# Altium schematic sheet SAMD_Arduino_1.SchDoc: SAMD Arduino
size A4; DrawnBy: Aakash Kumar; Organization: University of Colorado; Address1: Boulder; Address2: CO; DocumentNumber: 1; SheetNumber: 1; SheetTotal: 1
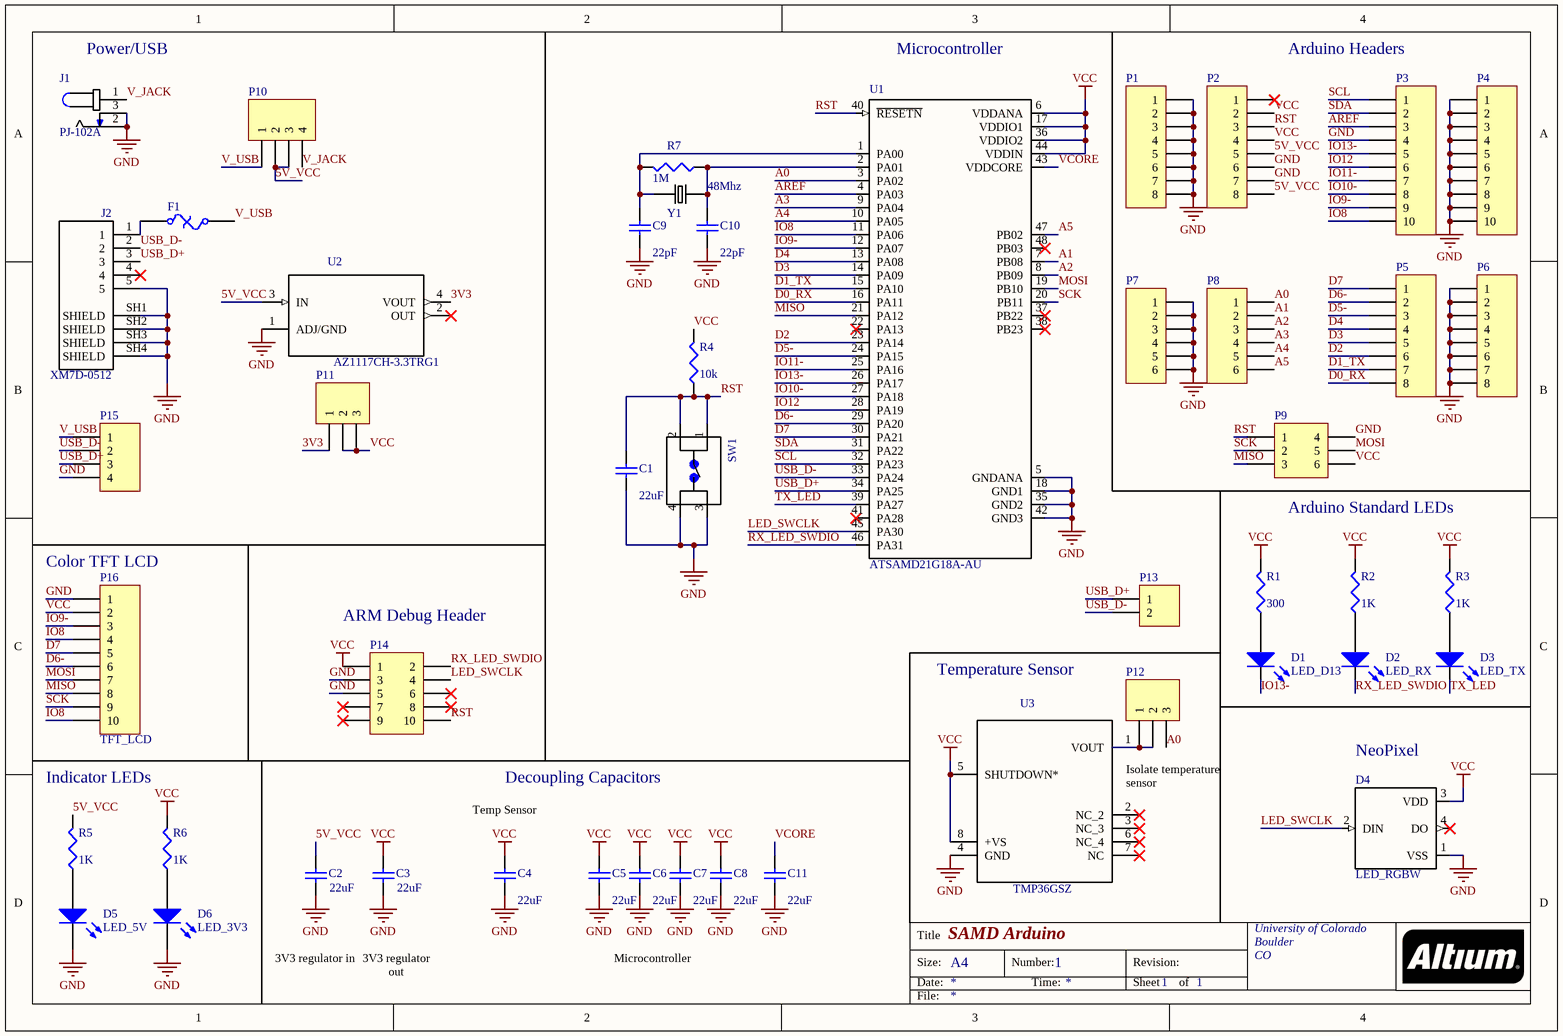
[diagram p0: SAMD_Arduino_1.SchDoc]

## Parts
C1  value 22uF  [C1206]  (hidden comment: Cap Semi)
C2  value 22uF  [C1206]  (hidden comment: Cap Semi)
C3  value 22uF  [C1206]  (hidden comment: Cap Semi)
C4  value 22uF  [C1206]  (hidden comment: Cap Semi)
C5  value 22uF  [C1206]  (hidden comment: Cap Semi)
C6  value 22uF  [C1206]  (hidden comment: Cap Semi)
C7  value 22uF  [C1206]  (hidden comment: Cap Semi)
C8  value 22uF  [C1206]  (hidden comment: Cap Semi)
C9  value 22pF  [C1206]  (hidden comment: Cap Semi)
C10  value 22pF  [C1206]  (hidden comment: Cap Semi)
C11  value 22uF  [C1206]  (hidden comment: Cap Semi)
D1  LED_D13  [3.2X1.6X1.1]
D2  LED_RX  [3.2X1.6X1.1]
D3  LED_TX  [3.2X1.6X1.1]
D4  LED_RGBW  [*LED_IN-PI554FCH]
D5  LED_5V  [3.2X1.6X1.1]
D6  LED_3V3  [3.2X1.6X1.1]
F1  Fuse Thermal  [1812]  (value not drawn)
J1  PJ-102A  [*CUI_PJ-102A]
J2  XM7D-0512  [*OMRON_XM7D-0512_XM7D-0512(Primary)]
P1  GND  [HDR1X8]  (value not drawn)
P2  P4  [HDR1X8]  (value not drawn)
P3  P1  [HDR1X10]  (value not drawn)
P4  GND  [HDR1X10]  (value not drawn)
P5  P2  [HDR1X8]  (value not drawn)
P6  GND  [HDR1X8]  (value not drawn)
P7  GND  [HDR1X6]  (value not drawn)
P8  P3  [HDR1X6]  (value not drawn)
P9  Header 3X2A  [HDR2X3_CEN]  (value not drawn)
P10  Header 4  [HDR1X4]  (value not drawn)
P11  3.3 NC  [HDR1X3]  (value not drawn)
P12  NC A0  [HDR1X3]  (value not drawn)
P13  Header 2  [HDR1X2]  (value not drawn)
P14  Header 5X2  [HDR2X5]  (value not drawn)
P15  Header 4  [HDR1X4]  (value not drawn)
P16  TFT_LCD  [HDR1X10]
R1  value 300  [C1206]  (hidden comment: Res3)
R2  value 1K  [C1206]  (hidden comment: Res3)
R3  value 1K  [C1206]  (hidden comment: Res3)
R4  value 10k  [C1206]  (hidden comment: Res3)
R5  value 1K  [C1206]  (hidden comment: Res3)
R6  value 1K  [C1206]  (hidden comment: Res3)
R7  value 1M  [C1206]  (hidden comment: Res3)
SW1  RESET  [*TE_FSM4JSMA]  (value not drawn)
U1  ATSAMD21G18A-AU  [*QFP50P900X900X120-48N]
U2  AZ1117CH-3.3TRG1  [*SOT230P696X180-4N]
U3  TMP36GSZ  [*SOIC127P600X175-8N]
Y1  value 48Mhz  [*XTAL_ECS-35-17-5PX-TR]  (hidden comment: ECS-35-17-5PX-TR)

## Nets
GND: C1.1 C2.1 C3.1 C4.1 C5.1 C6.1 C7.1 C8.1 C9.1 C10.1 C11.1 D4.1(VSS) D5.2(K) D6.2(K) J1.2 J1.3 J2.5 J2.SH1(SHIELD) J2.SH2(SHIELD) J2.SH3(SHIELD) J2.SH4(SHIELD) P1.1 P1.2 P1.3 P1.4 P1.5 P1.6 P1.7 P1.8 P2.6 P2.7 P3.4 P4.1 P4.2 P4.3 P4.4 P4.5 P4.6 P4.7 P4.8 P4.9 P4.10 P6.1 P6.2 P6.3 P6.4 P6.5 P6.6 P6.7 P6.8 P7.1 P7.2 P7.3 P7.4 P7.5 P7.6 P9.4 P14.3 P14.5 P15.4 P16.1 SW1.3 SW1.4 U1.5(GNDANA) U1.18(GND1) U1.35(GND2) U1.42(GND3) U2.1(ADJ/GND) U3.4(GND)
VCC: C3.2 C4.2 C5.2 C6.2 C7.2 C8.2 D4.3(VDD) P2.2 P2.4 P9.6 P11.2 P11.3 P14.1 P16.2 R1.2 R2.2 R3.2 R4.2 R6.2 U1.6(VDDANA) U1.17(VDDIO1) U1.36(VDDIO2) U1.44(VDDIN) U3.5(SHUTDOWN*) U3.8(+VS)
3V3: P11.1 U2.4(VOUT)
5V_VCC: C2.2 P2.5 P2.8 P10.2 P10.3 R5.2 U2.3(IN)
A0: P8.1 P12.3 U1.3(PA02)
A1: P8.2 U1.7(PB08)
A2: P8.3 U1.8(PB09)
A3: P8.4 U1.9(PA04)
A4: P8.5 U1.10(PA05)
A5: P8.6 U1.47(PB02)
AREF: P3.3 U1.4(PA03)
D0_RX: P5.8 U1.16(PA11)
D1_TX: P5.7 U1.15(PA10)
D2: P5.6 U1.23(PA14)
D3: P5.5 U1.14(PA09)
D4: P5.4 U1.13(PA08)
D5-: P5.3 U1.24(PA15)
D6-: P5.2 P16.6 U1.29(PA20)
D7: P5.1 P16.5 U1.30(PA21)
IO8: P3.10 P16.4 P16.10 U1.11(PA06)
IO9-: P3.9 P16.3 U1.12(PA07)
IO10-: P3.8 U1.27(PA18)
IO11-: P3.7 U1.25(PA16)
IO12: P3.6 U1.28(PA19)
IO13-: D1.2(K) P3.5 U1.26(PA17)
LED_SWCLK: D4.2(DIN) P14.4 U1.45(PA30)
MISO: P9.3 P16.8 U1.21(PA12)
MOSI: P9.5 P16.7 U1.19(PB10)
RST: C1.2 P2.3 P9.1 P14.10 R4.1 SW1.1 SW1.2 U1.40(~{RESETN})
RX_LED_SWDIO: D2.2(K) P14.2 U1.46(PA31)
SCK: P9.2 P16.9 U1.20(PB11)
SCL: P3.1 U1.32(PA23)
SDA: P3.2 U1.31(PA22)
TX_LED: D3.2(K) U1.39(PA27)
USB_D+: J2.3 P13.1 P15.3 U1.34(PA25)
USB_D-: J2.2 P13.2 P15.2 U1.33(PA24)
V_JACK: J1.1 P10.4
V_USB: F1.2 P10.1 P15.1
VCORE: C11.2 U1.43(VDDCORE)
NetC9_2: C9.2 R7.2 U1.1(PA00) Y1.1
NetC10_2: C10.2 R7.1 U1.2(PA01) Y1.2
NetD1_1: D1.1(A) R1.1
NetD2_1: D2.1(A) R2.1
NetD3_1: D3.1(A) R3.1
NetD5_1: D5.1(A) R5.1
NetD6_1: D6.1(A) R6.1
NetF1_1: F1.1 J2.1
NetP12_1: P12.1 P12.2 U3.1(VOUT)

Not connected (* = marked no-connect by the designer): D4 4(DO)*; J2 4*; P2 1*; P14 6* 7* 8* 9*; U1 22(PA13)* 37(PB22)* 38(PB23)* 41(PA28)* 48(PB03)*; U2 2(OUT)*; U3 2(NC_2)* 3(NC_3)* 6(NC_4)* 7(NC)*

## Notes on the sheet
- (near J1) Power/USB
- Microcontroller
- Arduino Headers
- Arduino Standard LEDs
- (near P16) Color TFT LCD
- (near P14) ARM Debug Header
- Temperature Sensor
- Indicator LEDs
- Decoupling Capacitors
- (near U3) Isolate temperature sensor
- (near D4) NeoPixel
- Temp Sensor
- 3V3 regulator in
- 3V3 regulator out
- Title
- Size:
- Date:
- A4
- Number:
- Time:
- Revision:
- Sheet
- of
- File:

## Library data of the parts
C1-C11 = Cap Semi: Capacitor (Semiconductor SIM Model); Published: 8-Jun-2000; LatestRevisionDate: 29-May-2009; LatestRevisionNote: IPC-7351 Footprint Added.; PackageReference: C1206; Publisher: Altium Limited; PackageDescription: Chip Capacitor
  C2-C8 C11: DigiKeyPartNo: 1276-3300-1-ND
  C9 C10: DigiKeyPartNo: 732-7867-1-ND
D1-D3 D5 D6 = LED2: Typical RED, GREEN, YELLOW, AMBER GaAs LED; Published: 8-Jun-2000; LatestRevisionDate: 17-Jul-2002; LatestRevisionNote: Re-released for DXP Platform.; PackageVersion: Feb-2002; PackageReference: 3.2X1.6X1.1; Publisher: Altium Limited; PackageDescription: SM LED; 2 Flat Leads
D4 = IN-PI554FCH: 5050RGB with integrated IC built in 4 PIN Â•Viewing angle: 120 degrees; MF: Inolux; Availability: Unavailable; Price: None; MP: IN-PI554FCH; Package: SMD-4 Innolux; SnapEDA_Link: https://www.snapeda.com/parts/IN-PI554FCH/Inolux/view-part/?ref=snap; Value: *; DigiKeyPartNo: 1830-1209-1-ND
F1 = Fuse Thermal: Thermal Fuse; ManufacturerPartNo: MF-MSMF050-2; Published: 24-Mar-1999; LatestRevisionDate: 17-Jul-2002; LatestRevisionNote: Re-released for DXP Platform.; PackageReference: 1812; Publisher: Altium Limited; PackageDescription: Thru-Hole; 2 Leads; DigiKeyPartNo: MF-MSMF050-2CT-ND
J1 = PJ-102A: 2.0 mm Center Pin, 2.5 A, Right Angle, Through Hole, Tapered Pins, Dc Power Jack Connector; MF: CUI Inc.; Price: None; CUI_purchase_URL: https://www.cui.com/product/interconnect/dc-power-connectors/jacks/2.0-mm-center-pin/pj-102a?utm_source=snapeda.com&utm_medium=referral&utm_campaign=snapedaBOM; Package: None; SnapEDA_Link: https://www.snapeda.com/parts/PJ-102A/CUI%20Inc./view-part/?ref=snap; Availability: Unavailable; MP: PJ-102A; Value: *
J2 = XM7D-0512: Conn Mini USB Type B SKT 5 POS 0.8mm Solder RA Thru-Hole 5 Terminal 1 Port; MF: Omron Electronics; Availability: Unavailable; MP: XM7D-0512; SnapEDA_Link: https://www.snapeda.com/parts/XM7D-0512/Omron%20Electronics%20Inc-EMC%20Div/view-part/?ref=snap; Price: None; Package: None; Value: *; ComponentLink1URL: https://www.digikey.com/product-detail/en/omron-electronics-inc-emc-div/XM7D-0512/OR1205-ND/4695531
P1 P2 P5 P6 = Header 8: Header, 8-Pin; LatestRevisionDate: 17-Jul-2002; LatestRevisionNote: Re-released for DXP Platform.; Publisher: Altium Limited
P3 P4 P16 = Header 10: Header, 10-Pin; LatestRevisionDate: 17-Jul-2002; LatestRevisionNote: Re-released for DXP Platform.; Publisher: Altium Limited
  P16: DigiKeyPartNo: 1212-1179-ND
P7 P8 = Header 6: Header, 6-Pin; LatestRevisionDate: 17-Jul-2002; LatestRevisionNote: Re-released for DXP Platform.; Publisher: Altium Limited
P9 = Header 3X2A: Header, 3-Pin, Dual row; LatestRevisionDate: 17-Jul-2002; LatestRevisionNote: Re-released for DXP Platform.; Publisher: Altium Limited
P10 P15 = Header 4: Header, 4-Pin; LatestRevisionDate: 17-Jul-2002; LatestRevisionNote: Re-released for DXP Platform.; Publisher: Altium Limited
P11 P12 = Header 3: Header, 3-Pin; LatestRevisionDate: 17-Jul-2002; LatestRevisionNote: Re-released for DXP Platform.; Publisher: Altium Limited
P13 = Header 2: Header, 2-Pin; LatestRevisionDate: 17-Jul-2002; LatestRevisionNote: Re-released for DXP Platform.; Publisher: Altium Limited
P14 = Header 5X2: Header, 5-Pin, Dual row; LatestRevisionDate: 17-Jul-2002; LatestRevisionNote: Re-released for DXP Platform.; Publisher: Altium Limited
R1-R7 = Res3: Resistor; Published: 8-Jun-2000; LatestRevisionDate: 29-May-2009; LatestRevisionNote: IPC-7351 Footprint Added.; Publisher: Altium Limited; PackageDescription: Chip Resistor
  R1-R3 R5 R6: PackageReference: J1-0603
  R4 R7: PackageReference: 1206
SW1 = FSM4JSMA: FSM4JSMA=SMT,TACTILE,PB SWITCH; MF: TE Connectivity; Package: None; EU_RoHS_Compliance: Compliant; TE_purchase_URL: https://www.te.com/usa-en/product-4-1437565-1.html?te_bu=Cor&te_type=disp&te_campaign=seda_glo_cor-seda-global-disp-prtnr-fy19-seda-model-bom-cta_sma-317_1&elqCampaignId=32493; MP: FSM4JSMA; Price: None; SnapEDA_Link: https://www.snapeda.com/parts/FSM4JSMA/TE%20Connectivity%20ALCOSWITCH%20Switches/view-part/?ref=snap; Availability: Unavailable; Value: *
U1 = ATSAMD21G18A-AU: SAMD21G Series 256 kB Flash 32 kB SRAM 48 MHz 32-Bit Microcontroller - TQFP-48; MF: Microchip; Package: TQFP-48 Microchip; MP: ATSAMD21G18A-AU; Price: None; Availability: Unavailable; SnapEDA_Link: https://www.snapeda.com/parts/ATSAMD21G18A-AU/Microchip/view-part/?ref=snap; Value: *
U2 = LM1117MP-3.3: Voltage stabiliser; LDO, fixed; 3.3V; 0.8A; SOT223; SMD; MF: Diodes Incorporated; Price: None; Package: SOT-223 Texas Instruments; SnapEDA_Link: https://www.snapeda.com/parts/LM1117MP-3.3/NOPB/Texas%20Instruments/view-part/?ref=snap; Availability: Unavailable; MP: AZ1117CH-3.3TRG1; Value: *; DigiKeyPartNo: AZ1117CH-3.3TRG1DICT-ND
U3 = TMP36GSZ: Temp Sensor Analog_Voltage_ Serial _2-Wire_ 8-Pin SOIC N Tube; MF: Analog Devices; Package: SOIC-8 Analog Devices; MP: TMP36GSZ; Price: None; SnapEDA_Link: https://www.snapeda.com/parts/TMP36GSZ/Analog%20Devices%20Inc./view-part/?ref=snap; Availability: Unavailable; Value: *
Y1 = ECS-35-17-5PX-TR: Crystal 3.579545MHz Â±30ppm _Tol_ Â±50ppm _Stability_ 17pF FUND 150Ohm 2-Pin HC-49/USX SMD T/R; MF: Abracon LLC; MP: ABLS-48.000MHZ-B2-T; Package: HC49/US ECS International; Price: None; Availability: Unavailable; SnapEDA_Link: https://www.snapeda.com/parts/ECS-35-17-5PX-TR/ECS%20Inc./view-part/?ref=snap; DigiKeyPartNo: 535-9083-1-ND